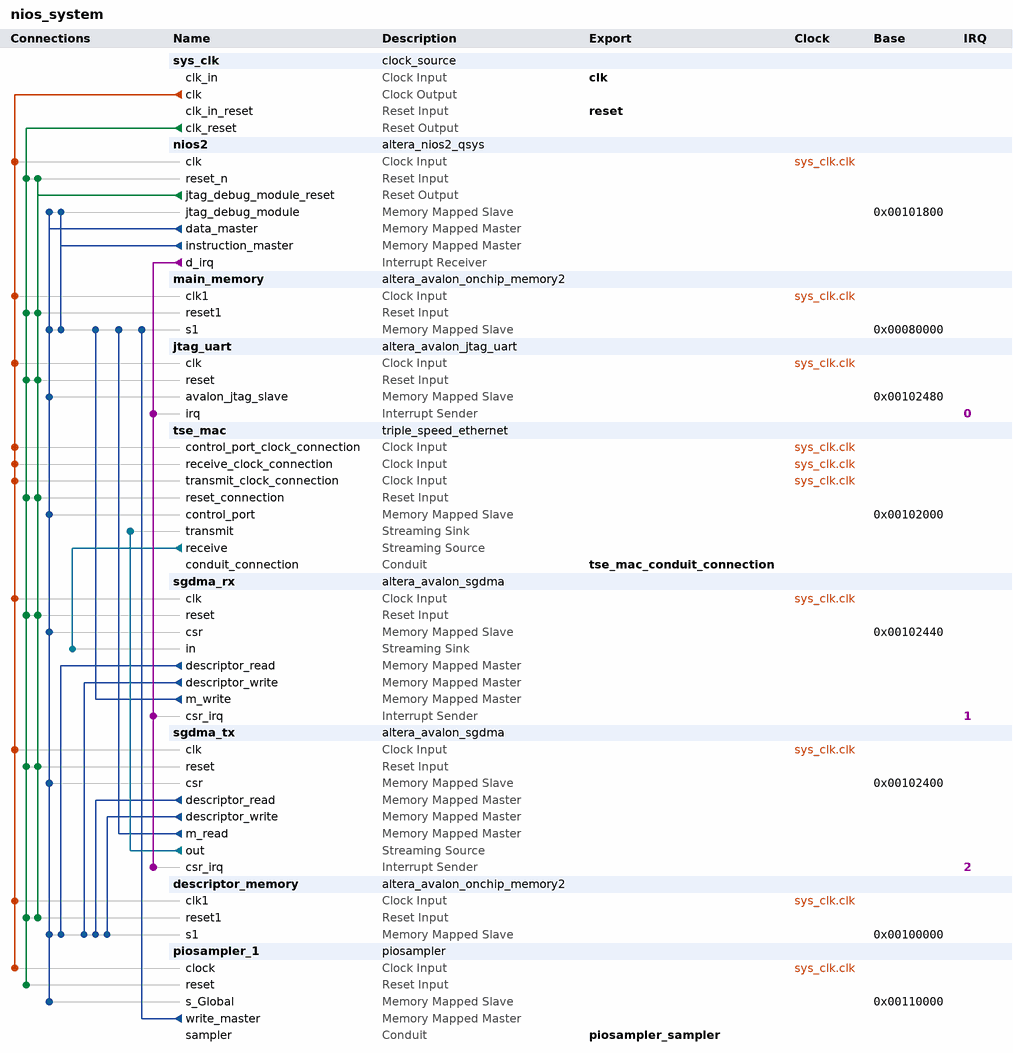
[diagram p0: system contents]
# Platform Designer (Qsys) system nios_system, Cyclone IV E EP4CE115F29C7
# Parameters at their usual value, and those the tool derives, are not listed.
package require -exact qsys 13.0.1
create_system nios_system
set_project_property DEVICE_FAMILY {Cyclone IV E}
set_project_property DEVICE EP4CE115F29C7

add_instance sys_clk clock_source 13.0
set_instance_parameter_value sys_clk clockFrequency 100000000

add_instance nios2 altera_nios2_qsys 13.0
set_instance_parameter_value nios2 resetSlave main_memory.s1
set_instance_parameter_value nios2 exceptionSlave main_memory.s1
set_instance_parameter_value nios2 breakSlave nios2.jtag_debug_module
set_instance_parameter_value nios2 impl Small
set_instance_parameter_value nios2 icache_size 4096

add_instance main_memory altera_avalon_onchip_memory2 13.0.1
set_instance_parameter_value main_memory dataWidth 32
set_instance_parameter_value main_memory dualPort false
set_instance_parameter_value main_memory initMemContent true
set_instance_parameter_value main_memory initializationFileName onchip_memory2
set_instance_parameter_value main_memory memorySize 300000

add_instance jtag_uart altera_avalon_jtag_uart 13.0.1
set_instance_parameter_value jtag_uart simInteractiveOptions INTERACTIVE_ASCII_OUTPUT

add_instance tse_mac triple_speed_ethernet 13.0
set_instance_parameter_value tse_mac atlanticSinkClockRate 0
set_instance_parameter_value tse_mac atlanticSinkClockSource unassigned
set_instance_parameter_value tse_mac atlanticSourceClockRate 0
set_instance_parameter_value tse_mac atlanticSourceClockSource unassigned
set_instance_parameter_value tse_mac avalonSlaveClockRate 0
set_instance_parameter_value tse_mac avalonSlaveClockSource unassigned
set_instance_parameter_value tse_mac avalonStNeighbours {unassigned=unassigned}
set_instance_parameter_value tse_mac channel_count 1
set_instance_parameter_value tse_mac core_variation MAC_ONLY
set_instance_parameter_value tse_mac core_version 3328
set_instance_parameter_value tse_mac crc32check16bit 0
set_instance_parameter_value tse_mac crc32dwidth 8
set_instance_parameter_value tse_mac crc32gendelay 6
set_instance_parameter_value tse_mac crc32s1l2_extern false
set_instance_parameter_value tse_mac cust_version 0
set_instance_parameter_value tse_mac dataBitsPerSymbol 8
set_instance_parameter_value tse_mac dev_version 3328
set_instance_parameter_value tse_mac eg_addr 11
set_instance_parameter_value tse_mac ena_hash false
set_instance_parameter_value tse_mac enable_alt_reconfig false
set_instance_parameter_value tse_mac enable_clk_sharing false
set_instance_parameter_value tse_mac enable_ena 32
set_instance_parameter_value tse_mac enable_fifoless false
set_instance_parameter_value tse_mac enable_gmii_loopback true
set_instance_parameter_value tse_mac enable_hd_logic true
set_instance_parameter_value tse_mac enable_mac_flow_ctrl false
set_instance_parameter_value tse_mac enable_mac_txaddr_set true
set_instance_parameter_value tse_mac enable_mac_vlan false
set_instance_parameter_value tse_mac enable_maclite false
set_instance_parameter_value tse_mac enable_magic_detect false
set_instance_parameter_value tse_mac enable_multi_channel false
set_instance_parameter_value tse_mac enable_pkt_class true
set_instance_parameter_value tse_mac enable_pma false
set_instance_parameter_value tse_mac enable_ptp_1step false
set_instance_parameter_value tse_mac enable_reg_sharing false
set_instance_parameter_value tse_mac enable_sgmii false
set_instance_parameter_value tse_mac enable_shift16 true
set_instance_parameter_value tse_mac enable_sup_addr false
set_instance_parameter_value tse_mac enable_timestamping false
set_instance_parameter_value tse_mac enable_use_internal_fifo true
set_instance_parameter_value tse_mac export_calblkclk false
set_instance_parameter_value tse_mac export_pwrdn false
set_instance_parameter_value tse_mac ext_stat_cnt_ena false
set_instance_parameter_value tse_mac gigeAdvanceMode true
set_instance_parameter_value tse_mac ifGMII RGMII
set_instance_parameter_value tse_mac ifPCSuseEmbeddedSerdes false
set_instance_parameter_value tse_mac ing_addr 11
set_instance_parameter_value tse_mac insert_ta true
set_instance_parameter_value tse_mac maclite_gige false
set_instance_parameter_value tse_mac max_channels 1
set_instance_parameter_value tse_mac mdio_clk_div 40
set_instance_parameter_value tse_mac phy_identifier 0
set_instance_parameter_value tse_mac ramType AUTO
set_instance_parameter_value tse_mac reset_level 1
set_instance_parameter_value tse_mac starting_channel_number 0
set_instance_parameter_value tse_mac stat_cnt_ena true
set_instance_parameter_value tse_mac timingAdapterName timingAdapter
set_instance_parameter_value tse_mac toolContext SOPC_BUILDER
set_instance_parameter_value tse_mac transceiver_type GXB
set_instance_parameter_value tse_mac tstamp_fp_width 4
set_instance_parameter_value tse_mac uiHostClockFrequency 0
set_instance_parameter_value tse_mac uiMDIOFreq {0.0 MHz}
set_instance_parameter_value tse_mac useLvds false
set_instance_parameter_value tse_mac useMAC true
set_instance_parameter_value tse_mac useMDIO true
set_instance_parameter_value tse_mac usePCS false
set_instance_parameter_value tse_mac use_sync_reset true

add_instance sgdma_rx altera_avalon_sgdma 13.0.1
set_instance_parameter_value sgdma_rx enableBurstTransfers false
set_instance_parameter_value sgdma_rx enableUnalignedTransfers false
set_instance_parameter_value sgdma_rx readBlockDataWidth 32
set_instance_parameter_value sgdma_rx sinkErrorWidth 6
set_instance_parameter_value sgdma_rx sourceErrorWidth 0
set_instance_parameter_value sgdma_rx transferMode STREAM_TO_MEMORY
set_instance_parameter_value sgdma_rx writeBurstcountWidth 4

add_instance sgdma_tx altera_avalon_sgdma 13.0.1
set_instance_parameter_value sgdma_tx enableBurstTransfers false
set_instance_parameter_value sgdma_tx enableUnalignedTransfers false
set_instance_parameter_value sgdma_tx readBlockDataWidth 32
set_instance_parameter_value sgdma_tx sinkErrorWidth 0
set_instance_parameter_value sgdma_tx sourceErrorWidth 1
set_instance_parameter_value sgdma_tx transferMode MEMORY_TO_STREAM
set_instance_parameter_value sgdma_tx writeBurstcountWidth 4

add_instance descriptor_memory altera_avalon_onchip_memory2 13.0.1
set_instance_parameter_value descriptor_memory dataWidth 32
set_instance_parameter_value descriptor_memory dualPort false
set_instance_parameter_value descriptor_memory initMemContent true
set_instance_parameter_value descriptor_memory initializationFileName descriptor_memory
set_instance_parameter_value descriptor_memory memorySize 4096

add_instance piosampler_1 piosampler 1.0
set_instance_parameter_value piosampler_1 RX_DATA_FIFO_DEPTH 4096

# connections
add_connection sys_clk.clk descriptor_memory.clk1 clock
add_connection sys_clk.clk jtag_uart.clk clock
add_connection sys_clk.clk main_memory.clk1 clock
add_connection sys_clk.clk nios2.clk clock
add_connection sys_clk.clk piosampler_1.clock clock
add_connection sys_clk.clk sgdma_rx.clk clock
add_connection sys_clk.clk sgdma_tx.clk clock
add_connection sys_clk.clk tse_mac.control_port_clock_connection clock
add_connection sys_clk.clk tse_mac.receive_clock_connection clock
add_connection sys_clk.clk tse_mac.transmit_clock_connection clock
add_connection nios2.jtag_debug_module_reset descriptor_memory.reset1 reset
add_connection nios2.jtag_debug_module_reset jtag_uart.reset reset
add_connection nios2.jtag_debug_module_reset main_memory.reset1 reset
add_connection nios2.jtag_debug_module_reset nios2.reset_n reset
add_connection nios2.jtag_debug_module_reset sgdma_rx.reset reset
add_connection nios2.jtag_debug_module_reset sgdma_tx.reset reset
add_connection nios2.jtag_debug_module_reset tse_mac.reset_connection reset
add_connection sys_clk.clk_reset descriptor_memory.reset1 reset
add_connection sys_clk.clk_reset jtag_uart.reset reset
add_connection sys_clk.clk_reset main_memory.reset1 reset
add_connection sys_clk.clk_reset nios2.reset_n reset
add_connection sys_clk.clk_reset piosampler_1.reset reset
add_connection sys_clk.clk_reset sgdma_rx.reset reset
add_connection sys_clk.clk_reset sgdma_tx.reset reset
add_connection sys_clk.clk_reset tse_mac.reset_connection reset
add_connection nios2.data_master descriptor_memory.s1 avalon
set_connection_parameter_value nios2.data_master/descriptor_memory.s1 baseAddress 0x00100000
add_connection nios2.data_master jtag_uart.avalon_jtag_slave avalon
set_connection_parameter_value nios2.data_master/jtag_uart.avalon_jtag_slave baseAddress 0x00102480
add_connection nios2.data_master main_memory.s1 avalon
set_connection_parameter_value nios2.data_master/main_memory.s1 baseAddress 0x00080000
add_connection nios2.data_master nios2.jtag_debug_module avalon
set_connection_parameter_value nios2.data_master/nios2.jtag_debug_module baseAddress 0x00101800
add_connection nios2.data_master piosampler_1.s_Global avalon
set_connection_parameter_value nios2.data_master/piosampler_1.s_Global baseAddress 0x00110000
add_connection nios2.data_master sgdma_rx.csr avalon
set_connection_parameter_value nios2.data_master/sgdma_rx.csr baseAddress 0x00102440
add_connection nios2.data_master sgdma_tx.csr avalon
set_connection_parameter_value nios2.data_master/sgdma_tx.csr baseAddress 0x00102400
add_connection nios2.data_master tse_mac.control_port avalon
set_connection_parameter_value nios2.data_master/tse_mac.control_port baseAddress 0x00102000
add_connection nios2.instruction_master main_memory.s1 avalon
set_connection_parameter_value nios2.instruction_master/main_memory.s1 baseAddress 0x00080000
add_connection nios2.instruction_master nios2.jtag_debug_module avalon
set_connection_parameter_value nios2.instruction_master/nios2.jtag_debug_module baseAddress 0x00101800
add_connection piosampler_1.write_master main_memory.s1 avalon
set_connection_parameter_value piosampler_1.write_master/main_memory.s1 baseAddress 0x00080000
add_connection sgdma_rx.descriptor_read descriptor_memory.s1 avalon
set_connection_parameter_value sgdma_rx.descriptor_read/descriptor_memory.s1 baseAddress 0x00100000
add_connection sgdma_rx.descriptor_write descriptor_memory.s1 avalon
set_connection_parameter_value sgdma_rx.descriptor_write/descriptor_memory.s1 baseAddress 0x00100000
add_connection sgdma_rx.m_write main_memory.s1 avalon
set_connection_parameter_value sgdma_rx.m_write/main_memory.s1 baseAddress 0x00080000
add_connection sgdma_tx.descriptor_read descriptor_memory.s1 avalon
set_connection_parameter_value sgdma_tx.descriptor_read/descriptor_memory.s1 baseAddress 0x00100000
add_connection sgdma_tx.descriptor_write descriptor_memory.s1 avalon
set_connection_parameter_value sgdma_tx.descriptor_write/descriptor_memory.s1 baseAddress 0x00100000
add_connection sgdma_tx.m_read main_memory.s1 avalon
set_connection_parameter_value sgdma_tx.m_read/main_memory.s1 baseAddress 0x00080000
add_connection sgdma_tx.out tse_mac.transmit avalon_streaming
add_connection tse_mac.receive sgdma_rx.in avalon_streaming
add_connection nios2.d_irq jtag_uart.irq interrupt
set_connection_parameter_value nios2.d_irq/jtag_uart.irq irqNumber 0
add_connection nios2.d_irq sgdma_rx.csr_irq interrupt
set_connection_parameter_value nios2.d_irq/sgdma_rx.csr_irq irqNumber 1
add_connection nios2.d_irq sgdma_tx.csr_irq interrupt
set_connection_parameter_value nios2.d_irq/sgdma_tx.csr_irq irqNumber 2

# exported interfaces
add_interface reset reset sink
set_interface_property reset EXPORT_OF sys_clk.clk_in_reset
add_interface tse_mac_conduit_connection conduit end
set_interface_property tse_mac_conduit_connection EXPORT_OF tse_mac.conduit_connection
add_interface clk clock sink
set_interface_property clk EXPORT_OF sys_clk.clk_in
add_interface piosampler_sampler conduit end
set_interface_property piosampler_sampler EXPORT_OF piosampler_1.sampler

set_interconnect_requirement {$system} qsys_mm.clockCrossingAdapter HANDSHAKE
set_interconnect_requirement {$system} qsys_mm.maxAdditionalLatency 0

save_system nios_system.qsys
